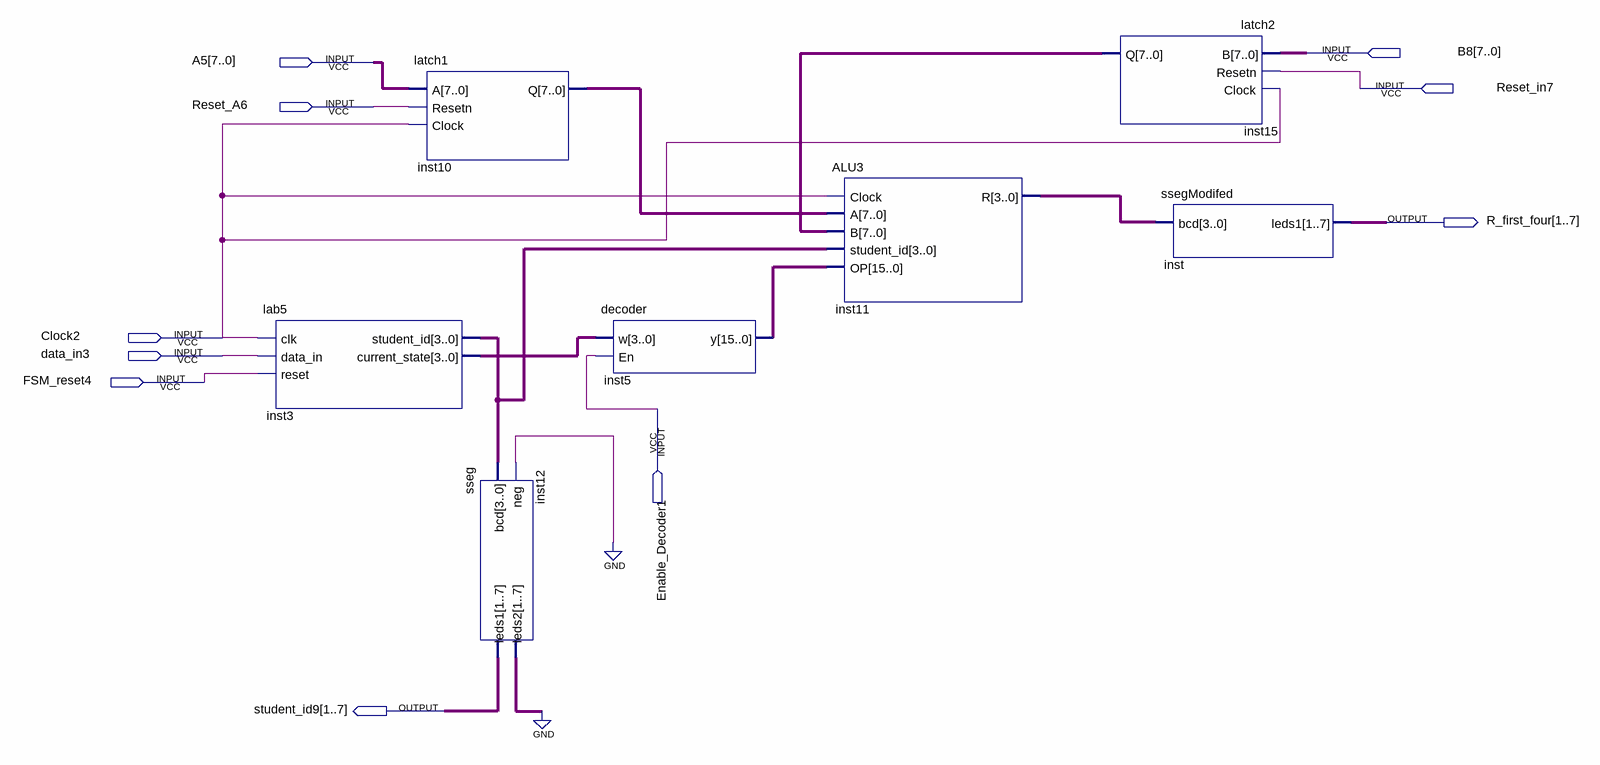
[diagram p0: schematic sheet]
// Quartus schematic ALU_P3.bdf as structural Verilog: 7 symbols, 10 pins
module ALU_P3 (
  input  [7:0] B8,
  input  [7:0] A5,
  input  Reset_in7,
  input  Reset_A6,
  input  Clock2,
  input  data_in3,
  input  FSM_reset4,
  input  Enable_Decoder1,
  output [1:7] R_first_four,
  output [1:7] student_id9
);

  wire [3:0] inst3_current_state, inst3_student_id, inst11_r;
  wire [6:0] inst12_leds2;
  wire [7:0] inst10_q, inst15_q;
  wire [15:0] inst5_y;

  lab5 inst3 (
    .clk(Clock2), .data_in(data_in3), .reset(FSM_reset4), .student_id(inst3_student_id),
    .current_state(inst3_current_state));
  latch1 inst10 (.A(A5), .Resetn(Reset_A6), .Clock(Clock2), .Q(inst10_q));
  sseg inst12 (.bcd(inst3_student_id), .neg(1'b0), .leds1(student_id9), .leds2(inst12_leds2));
  decoder inst5 (.w(inst3_current_state), .En(Enable_Decoder1), .y(inst5_y));
  ALU3 inst11 (.Clock(Clock2), .A(inst10_q), .B(inst15_q), .student_id(inst3_student_id), .OP(inst5_y), .R(inst11_r));
  latch2 inst15 (.B(B8), .Resetn(Reset_in7), .Clock(Clock2), .Q(inst15_q));
  ssegModifed inst (.bcd(inst11_r), .leds1(R_first_four));
  // also tied to GND on the sheet: {inst12_leds2[0], inst12_leds2[1], inst12_leds2[2], inst12_leds2[3], inst12_leds2[4], inst12_leds2[5], inst12_leds2[6]}
endmodule
